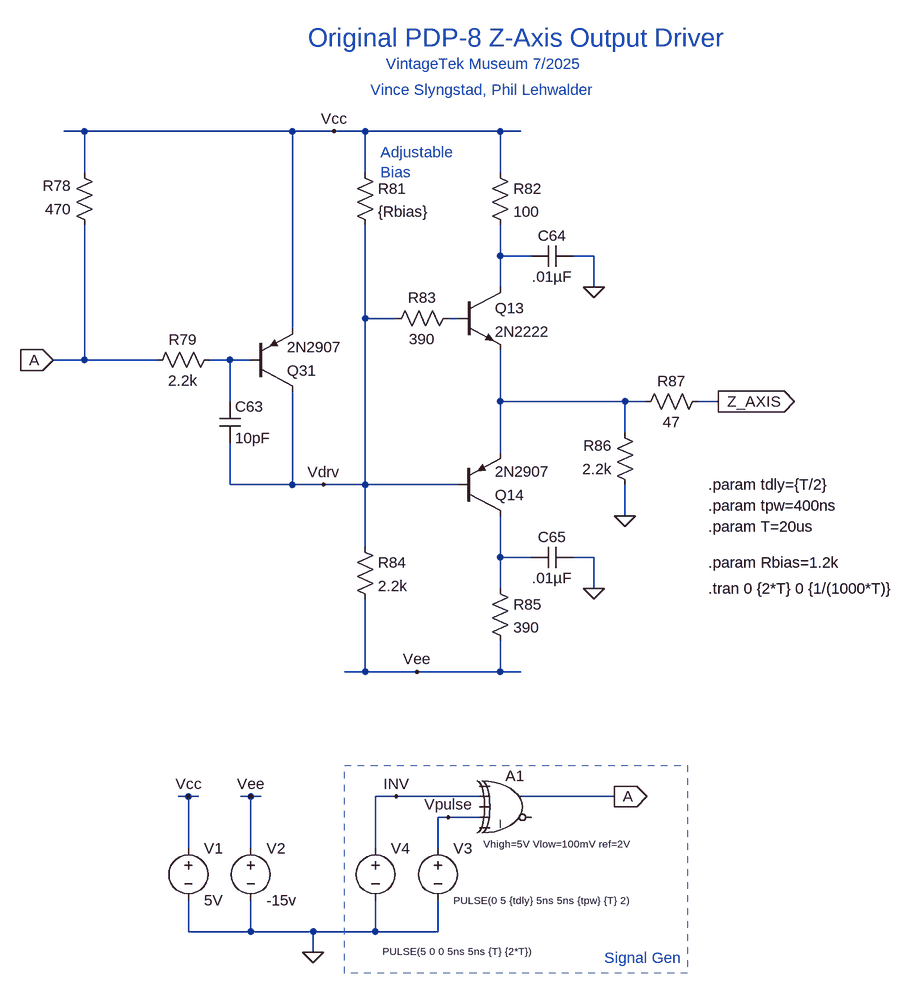
[diagram p0: schematic zaxis_buffer_tran_Orignal.asc]
zaxis_buffer_tran_Orignal.asc, the LTspice schematic file:
Version 4
SHEET 1 1656 1140
WIRE -176 -160 -208 -160
WIRE 144 -160 -176 -160
WIRE 208 -160 144 -160
WIRE 256 -160 208 -160
WIRE 464 -160 256 -160
WIRE 496 -160 464 -160
WIRE -176 -96 -176 -160
WIRE 256 -96 256 -160
WIRE 464 -96 464 -160
WIRE 464 32 464 -16
WIRE 512 32 464 32
WIRE 608 32 576 32
WIRE 464 80 464 32
WIRE 608 80 608 32
WIRE 256 128 256 -16
WIRE 304 128 256 128
WIRE 400 128 384 128
WIRE 144 144 144 -160
WIRE -176 192 -176 -16
WIRE -176 192 -224 192
WIRE -64 192 -176 192
WIRE 48 192 16 192
WIRE 80 192 48 192
WIRE 48 256 48 192
WIRE 464 256 464 176
WIRE 656 256 464 256
WIRE 688 256 656 256
WIRE 800 256 768 256
WIRE 656 304 656 256
WIRE 464 336 464 256
WIRE 48 384 48 320
WIRE 144 384 144 240
WIRE 144 384 48 384
WIRE 192 384 144 384
WIRE 256 384 256 128
WIRE 256 384 192 384
WIRE 400 384 256 384
WIRE 656 432 656 384
WIRE 256 480 256 384
WIRE 464 496 464 432
WIRE 512 496 464 496
WIRE 608 496 576 496
WIRE 464 544 464 496
WIRE 608 544 608 496
WIRE 256 672 256 560
WIRE 256 672 224 672
WIRE 336 672 256 672
WIRE 464 672 464 624
WIRE 464 672 336 672
WIRE 496 672 464 672
WIRE -16 864 -32 864
WIRE 0 864 -16 864
WIRE 80 864 64 864
WIRE 96 864 80 864
WIRE 304 864 272 864
WIRE 432 864 304 864
WIRE 640 864 496 864
WIRE 384 896 368 896
WIRE 432 896 384 896
WIRE -16 944 -16 864
WIRE 80 944 80 864
WIRE 272 944 272 864
WIRE 368 944 368 896
WIRE -16 1072 -16 1024
WIRE 80 1072 80 1024
WIRE 80 1072 -16 1072
WIRE 176 1072 80 1072
WIRE 272 1072 272 1024
WIRE 272 1072 176 1072
WIRE 368 1072 368 1024
WIRE 368 1072 272 1072
WIRE 176 1104 176 1072
FLAG 208 -160 Vcc
FLAG 800 256 Z_AXIS
IOPIN 800 256 Out
FLAG 656 432 0
FLAG 608 544 0
FLAG 608 80 0
FLAG 336 672 Vee
FLAG -16 864 Vcc
FLAG 80 864 Vee
FLAG 176 1104 0
FLAG 640 864 A
IOPIN 640 864 Out
FLAG 304 864 INV
FLAG 384 896 Vpulse
FLAG -224 192 A
IOPIN -224 192 In
FLAG 192 384 Vdrv
SYMBOL res 240 -112 R0
SYMATTR InstName R81
SYMATTR Value {Rbias}
SYMBOL pnp 80 240 M180
SYMATTR InstName Q31
SYMATTR Value 2N2907
SYMBOL npn 400 80 R0
SYMATTR InstName Q13
SYMATTR Value 2N2222
SYMBOL pnp 400 432 M180
SYMATTR InstName Q14
SYMATTR Value 2N2907
SYMBOL res 448 -112 R0
SYMATTR InstName R82
SYMATTR Value 100
SYMBOL res 448 528 R0
SYMATTR InstName R85
SYMATTR Value 390
SYMBOL res 784 240 R90
WINDOW 0 0 56 VBottom 2
WINDOW 3 32 56 VTop 2
SYMATTR InstName R87
SYMATTR Value 47
SYMBOL res 672 400 R180
WINDOW 0 36 76 Left 2
WINDOW 3 36 40 Left 2
SYMATTR InstName R86
SYMATTR Value 2.2k
SYMBOL res 240 464 R0
SYMATTR InstName R84
SYMATTR Value 2.2k
SYMBOL res 32 176 R90
WINDOW 0 0 56 VBottom 2
WINDOW 3 32 56 VTop 2
SYMATTR InstName R79
SYMATTR Value 2.2k
SYMBOL res -160 0 R180
WINDOW 0 36 76 Left 2
WINDOW 3 36 40 Left 2
SYMATTR InstName R78
SYMATTR Value 470
SYMBOL res 400 112 R90
WINDOW 0 0 56 VBottom 2
WINDOW 3 32 56 VTop 2
SYMATTR InstName R83
SYMATTR Value 390
SYMBOL cap 32 256 R0
SYMATTR InstName C63
SYMATTR Value 10pF
SYMBOL cap 576 480 R90
WINDOW 0 0 32 VBottom 2
WINDOW 3 32 32 VTop 2
SYMATTR InstName C65
SYMATTR Value .01µF
SYMBOL cap 576 16 R90
WINDOW 0 0 32 VBottom 2
WINDOW 3 32 32 VTop 2
SYMATTR InstName C64
SYMATTR Value .01µF
SYMBOL voltage -16 928 R0
WINDOW 123 0 0 Left 0
WINDOW 39 0 0 Left 0
SYMATTR InstName V1
SYMATTR Value 5V
SYMBOL voltage 80 928 R0
WINDOW 123 0 0 Left 0
WINDOW 39 0 0 Left 0
SYMATTR InstName V2
SYMATTR Value -15v
SYMBOL voltage 368 928 R0
WINDOW 3 24 96 Left 1
WINDOW 123 0 0 Left 0
WINDOW 39 0 0 Left 0
SYMATTR Value PULSE(0 5 {tdly} 5ns 5ns {tpw} {T} 2)
SYMATTR InstName V3
SYMBOL Digital\\xor 480 816 R0
WINDOW 3 -42 121 Left 1
SYMATTR Value Vhigh=5V Vlow=100mV ref=2V
SYMATTR InstName A1
SYMBOL voltage 272 928 R0
WINDOW 3 11 174 Left 1
WINDOW 123 0 0 Left 0
WINDOW 39 0 0 Left 0
SYMATTR Value PULSE(5 0 0 5ns 5ns {T} {2*T})
SYMATTR InstName V4
TEXT 280 -128 Left 2 ;Adjustable\nBias
TEXT 784 384 Left 2 !.param tdly={T/2}
TEXT 784 416 Left 2 !.param tpw=400ns
TEXT 784 448 Left 2 !.param T=20us
TEXT 784 504 Left 2 !.param Rbias=1.2k
TEXT 784 544 Left 2 !.tran 0 {2*T} 0 {1/(1000*T)}
TEXT 624 1112 Left 2 ;Signal Gen
TEXT 168 -304 Left 4 ;Original PDP-8 Z-Axis Output Driver
TEXT 288 -264 Left 2 ;VintageTek Museum 7/2025
TEXT 264 -224 Left 2 ;Vince Slyngstad, Phil Lehwalder
RECTANGLE Normal 752 1136 224 816 2

The netlist it stands for:
* zaxis_buffer_tran_Orignal.asc
R81 Vcc Vdrv {Rbias}
Q31 Vdrv N003 Vcc 0 2N2907
Q13 N001 N002 N004 0 2N2222
Q14 N005 Vdrv N004 0 2N2907
R82 Vcc N001 100
R85 N005 Vee 390
R87 Z_AXIS N004 47
R86 0 N004 2.2k
R84 Vdrv Vee 2.2k
R79 N003 A 2.2k
R78 A Vcc 470
R83 N002 Vdrv 390
C63 N003 Vdrv 10pF
C65 0 N005 .01µF
C64 0 N001 .01µF
V1 Vcc 0 5V
V2 Vee 0 -15v
V3 Vpulse 0 PULSE(0 5 {tdly} 5ns 5ns {tpw} {T} 2)
A1 0 INV 0 Vpulse 0 0 A 0 XOR Vhigh=5V Vlow=100mV ref=2V
V4 INV 0 PULSE(5 0 0 5ns 5ns {T} {2*T})
.model NPN NPN
.model PNP PNP
.lib standard.bjt
* Adjustable
* Bias
.param tdly={T/2}
.param tpw=400ns
.param T=20us
.param Rbias=1.2k
.tran 0 {2*T} 0 {1/(1000*T)}
* Signal Gen
* Original PDP-8 Z-Axis Output Driver
* VintageTek Museum 7/2025
* Vince Slyngstad, Phil Lehwalder
.backanno
.end